# EAGLE design 3yp_node (EAGLE 9.5.2)
DOC_NUM: 1; REV: 2B
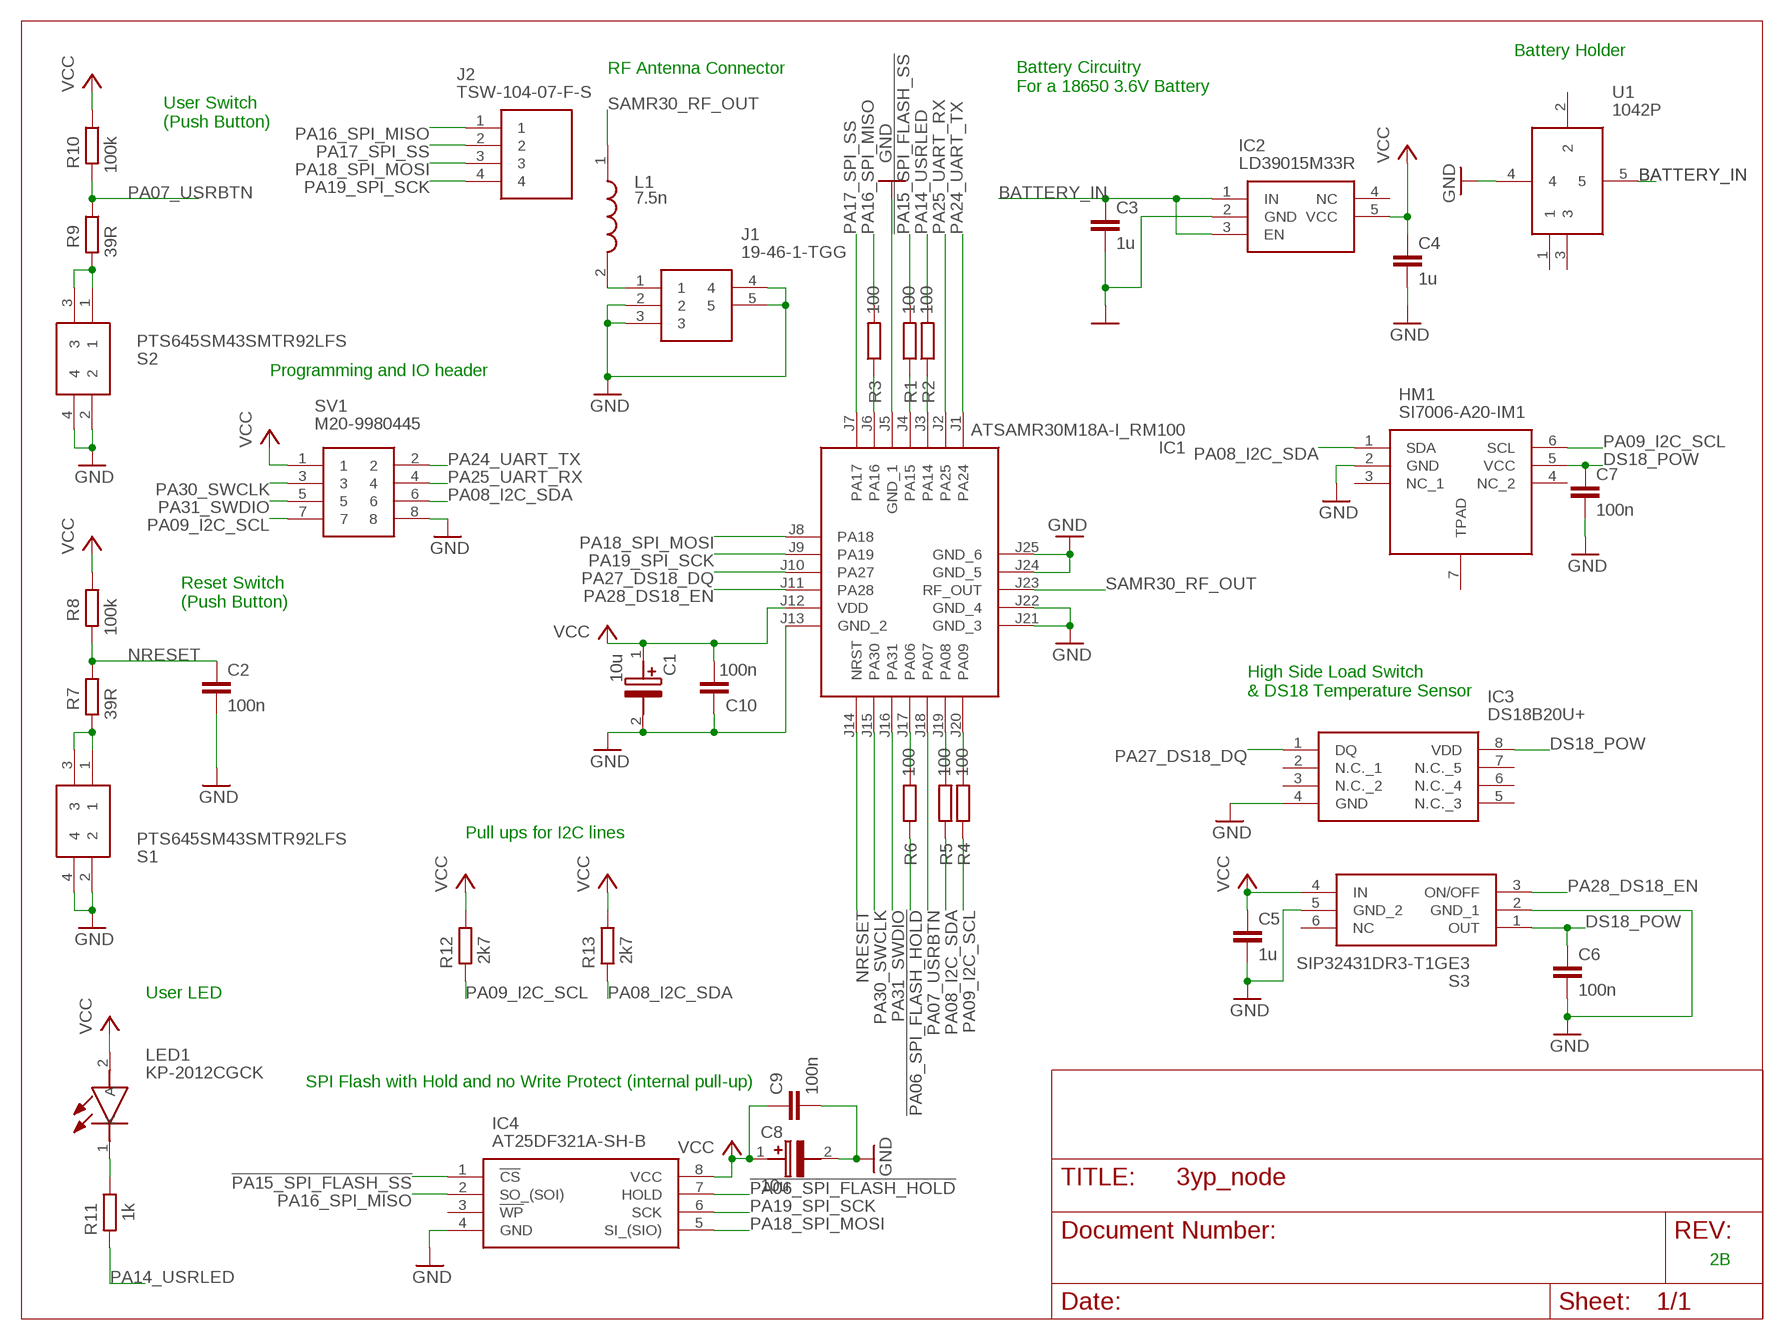
[diagram p0: schematic, sheet 1]

## Parts
C1  10u  TAJP106K006RNJ  [CAPPM2014X170N]
C2  100n  C-EUC0805  [C0805]
C3  1u  C-EUC0805  [C0805]
C4  1u  C-EUC0805  [C0805]
C5  1u  C-EUC0805  [C0805]
C6  100n  C-EUC0805  [C0805]
C7  100n  C-EUC0805  [C0805]
C8  10u  TAJP106K006RNJ  [CAPPM2014X170N]
C9  100n  C-EUC0805  [C0805]
C10  100n  C-EUC0805  [C0805]
HM1  SI7006-A20-IM1  [SON100P300X300X80-7N]
IC1  ATSAMR30M18A-I_RM100  [ATSAMR30M18AIRM100]
IC2  LD39015M33R  [SOT95P280X145-5N]
IC3  DS18B20U+  [SOP65P490X110-8N]
IC4  AT25DF321A-SH-B  [SOIC127P798X216-8N]
J1  19-46-1-TGG  [19-46-1-TGG_1]
J2  TSW-104-07-F-S  [HDRV4W64P254_1X4_1016X241X838P]
L1  7.5n  MHQ1005P10NJT  [INDC1006X60N]
LED1  KP-2012CGCK  [LEDC2012X110N]
R1  100  R-EU_R0603  [R0603]
R2  100  R-EU_R0603  [R0603]
R3  100  R-EU_R0603  [R0603]
R4  100  R-EU_R0603  [R0603]
R5  100  R-EU_R0603  [R0603]
R6  100  R-EU_R0603  [R0603]
R7  39R  R-EU_R0603  [R0603]
R8  100k  R-EU_R0603  [R0603]
R9  39R  R-EU_R0603  [R0603]
R10  100k  R-EU_R0603  [R0603]
R11  1k  R-EU_R0603  [R0603]
R12  2k7  R-EU_R0603  [R0603]
R13  2k7  R-EU_R0603  [R0603]
S1  PTS645SM43SMTR92LFS  [PTS645(SMT)]
S2  PTS645SM43SMTR92LFS  [PTS645(SMT)]
S3  SIP32431DR3-T1GE3  [SOT65P210X110-6N]
SV1  M20-9980445  [HDRV8W64P254_2X4_1016X508X868P]
U1  1042P  [1042P]

## Nets
!PA06_SPI_FLASH_HOLD: IC4.7(HOLD) R6.1
!PA15_SPI_FLASH_SS: IC4.1(!CS) R1.2
BATTERY_IN: C3.1 IC2.1(IN) IC2.3(EN) U1.5
DS18_POW: C6.1 C7.1 HM1.5(VCC) IC3.8(VDD) S3.1(OUT)
GND: C1.2(-) C2.2 C3.2 C4.2 C5.2 C6.2 C7.2 C8.2(-) C9.2 C10.1 HM1.2(GND) IC1.J5(GND_1) IC1.J13(GND_2) IC1.J21(GND_3) IC1.J22(GND_4) IC1.J24(GND_5) IC1.J25(GND_6) IC2.2(GND) IC3.4(GND) IC4.4(GND) J1.2 J1.3 J1.4 J1.5 S1.2 S1.4 S2.2 S2.4 S3.2(GND_1) S3.5(GND_2) SV1.8 U1.4
N$1: R9.2 S2.1 S2.3
N$2: IC1.J4(PA15) R1.1
N$3: IC1.J6(PA16) R3.1
N$4: IC1.J3(PA14) R2.1
N$5: IC1.J17(PA06) R6.2
N$6: IC1.J19(PA08) R5.2
N$7: IC1.J20(PA09) R4.2
N$8: R7.2 S1.1 S1.3
N$9: LED1.1(K) R11.1
N$10: J1.1 L1.2
NRESET: C2.1 IC1.J14(NRST) R7.1 R8.2
PA07_USRBTN: IC1.J18(PA07) R9.1 R10.2
PA08_I2C_SDA: HM1.1(SDA) R5.1 R13.2 SV1.6
PA09_I2C_SCL: HM1.6(SCL) R4.1 R12.2 SV1.7
PA14_USRLED: R2.2 R11.2
PA16_SPI_MISO: IC4.2(SO_(SOI)) J2.1 R3.2
PA17_SPI_SS: IC1.J7(PA17) J2.2
PA18_SPI_MOSI: IC1.J8(PA18) IC4.5(SI_(SIO)) J2.3
PA19_SPI_SCK: IC1.J9(PA19) IC4.6(SCK) J2.4
PA24_UART_TX: IC1.J1(PA24) SV1.2
PA25_UART_RX: IC1.J2(PA25) SV1.4
PA27_DS18_DQ: IC1.J10(PA27) IC3.1(DQ)
PA28_DS18_EN: IC1.J11(PA28) S3.3(ON/OFF)
PA30_SWCLK: IC1.J15(PA30) SV1.3
PA31_SWDIO: IC1.J16(PA31) SV1.5
SAMR30_RF_OUT: IC1.J23(RF_OUT) L1.1
VCC: C1.1(+) C4.1 C5.1 C8.1(+) C9.1 C10.2 IC1.J12(VDD) IC2.5(VCC) IC4.8(VCC) LED1.2(A) R8.1 R10.1 R12.1 R13.1 S3.4(IN) SV1.1
Unconnected: HM1.3(NC_1) HM1.4(NC_2) HM1.7(TPAD) IC2.4(NC) IC3.2(N.C._1) IC3.3(N.C._2) IC3.5(N.C._3) IC3.6(N.C._4) IC3.7(N.C._5) IC4.3(!WP) S3.6(NC) U1.1 U1.2 U1.3

## Notes on the sheet
- Battery Holder
- RF Antenna Connector
- Battery Circuitry
  For a 18650 3.6V Battery
- User Switch
  (Push Button)
- Programming and IO header
- Reset Switch 
  (Push Button)
- High Side Load Switch
  & DS18 Temperature Sensor
- Pull ups for I2C lines
- User LED
- SPI Flash with Hold and no Write Protect (internal pull-up)

## Library data of the parts
C1 C8 = SamacSys_Parts:TAJP106K006RNJ: Tantalum Capacitors - Solid SMD 6.3volts 10uF 10% 0805 Low Profile SMD Source: Datasheet <http://datasheets.avx.com/TAJ.pdf>; DESCRIPTION: Tantalum Capacitors - Solid SMD 6.3volts 10uF 10% 0805 Low Profile SMD; HEIGHT: 1.7mm; MANUFACTURER_NAME: AVX; MANUFACTURER_PART_NUMBER: TAJP106K006RNJ; MOUSER_PART_NUMBER: 581-TAJP106K006RNJ; MOUSER_PRICE-STOCK: https://www.mouser.com/Search/Refine.aspx?Keyword=581-TAJP106K006RNJ
C2-C7 C9 C10 = rcl:C-EU: CAPACITOR, European symbol; SPICEPREFIX: C
HM1 = SamacSys_Parts:SI7006-A20-IM1: Si7006 Digital RH temp sensor w filter Silicon Labs Si7006-A20-IM1 Temperature & Humidity Sensor, -40 +125 C, 6-Pin DFN Source: Datasheet <https://www.silabs.com/documents/public/data-sheets/Si7006-A20.pdf>; DESCRIPTION: Si7006 Digital RH temp sensor w filter Silicon Labs Si7006-A20-IM1 Temperature & Humidity Sensor, -40 +125 C, 6-Pin DFN; HEIGHT: 0.8mm; MANUFACTURER_NAME: Silicon Labs; MANUFACTURER_PART_NUMBER: Si7006-A20-IM1; MOUSER_PART_NUMBER: 634-SI7006-A20-IM1; MOUSER_PRICE-STOCK: https://www.mouser.com/Search/Refine.aspx?Keyword=634-SI7006-A20-IM1; RS_PART_NUMBER: 8652283P; RS_PRICE-STOCK: http://uk.rs-online.com/web/p/products/8652283P
IC1 = SamacSys_Parts:ATSAMR30M18A-I_RM100: Microchip Technology, ATSAMR30M18A-I/RM1 Source: Datasheet <http://www.mouser.com/datasheet/2/268/70005384A-1532404.pdf>; DESCRIPTION: Microchip Technology, ATSAMR30M18A-I/RM1; HEIGHT: 2.1mm; MANUFACTURER_NAME: Microchip; MANUFACTURER_PART_NUMBER: ATSAMR30M18A-I/RM100; MOUSER_PART_NUMBER: 556-AMR30M18AIRM100; MOUSER_PRICE-STOCK: https://www.mouser.com/Search/Refine.aspx?Keyword=556-AMR30M18AIRM100; RS_PART_NUMBER: 1840450; RS_PRICE-STOCK: http://uk.rs-online.com/web/p/products/1840450
IC2 = SamacSys_Parts:LD39015M33R: LD39015M33R, Low Dropout Voltage Regulator, 150mA, 3.3 V +/-2%, 1.5 5.5 Vin, 5-Pin SOT-23 Source: Datasheet <http://www.st.com/web/en/resource/technical/document/datasheet/CD00173477.pdf>; ALLIED_NUMBER: 70521225; ALLIED_PRICE-STOCK: http://www.alliedelec.com/stmicroelectronics-ld39015m33r/70521225/; DESCRIPTION: LD39015M33R, Low Dropout Voltage Regulator, 150mA, 3.3 V +/-2%, 1.5 5.5 Vin, 5-Pin SOT-23; HEIGHT: 1.45mm; MANUFACTURER_NAME: STMicroelectronics; MANUFACTURER_PART_NUMBER: LD39015M33R; MOUSER_PART_NUMBER: 511-LD39015M33R; MOUSER_PRICE-STOCK: https://www.mouser.com/Search/Refine.aspx?Keyword=511-LD39015M33R; RS_PART_NUMBER: 7958965P; RS_PRICE-STOCK: http://uk.rs-online.com/web/p/products/7958965P
IC3 = SamacSys_Parts:DS18B20U+: Board Mount Temperature Sensors Prgmble Resolution 1-Wire Parasite Pwr Source: Datasheet <https://componentsearchengine.com/Datasheets/1/DS18B20U .pdf>; DESCRIPTION: Board Mount Temperature Sensors Prgmble Resolution 1-Wire Parasite Pwr; HEIGHT: 1.1mm; MANUFACTURER_NAME: Maxim Integrated; MANUFACTURER_PART_NUMBER: DS18B20U+; MOUSER_PART_NUMBER: 700-DS18B20U; MOUSER_PRICE-STOCK: https://www.mouser.com/Search/Refine.aspx?Keyword=700-DS18B20U
IC4 = SamacSys_Parts:AT25DF321A-SH-B: Flash Memory 32M 2.7-3.6V, 100Mhz Serial Flash Source: Datasheet <http://docs-emea.rs-online.com/webdocs/0efc/0900766b80efc106.pdf>; DESCRIPTION: Flash Memory 32M 2.7-3.6V, 100Mhz Serial Flash; HEIGHT: 2.16mm; MANUFACTURER_NAME: Adesto Technologies; MANUFACTURER_PART_NUMBER: AT25DF321A-SH-B; MOUSER_PART_NUMBER: 556-AT25DF321A-SH-B; MOUSER_PRICE-STOCK: https://www.mouser.com/Search/Refine.aspx?Keyword=556-AT25DF321A-SH-B
J1 = SamacSys_Parts:19-46-1-TGG: MULTICOMP - 19-46-1-TGG - RF COAXIAL, SMA, STRAIGHT JACK, 50OHM Source: Datasheet <http://www.farnell.com/datasheets/1661858.pdf>; DESCRIPTION: MULTICOMP - 19-46-1-TGG - RF COAXIAL, SMA, STRAIGHT JACK, 50OHM; HEIGHT: mm; MANUFACTURER_NAME: MULTICOMP; MANUFACTURER_PART_NUMBER: 19-46-1-TGG
J2 = SamacSys_Parts:TSW-104-07-F-S: CONN HEADER 4 POS .100" Source: Datasheet <http://suddendocs.samtec.com/catalog_english/tsw_th.pdf>; DESCRIPTION: CONN HEADER 4 POS .100"; HEIGHT: 8.38mm; MANUFACTURER_NAME: SAMTEC; MANUFACTURER_PART_NUMBER: TSW-104-07-F-S; MOUSER_PART_NUMBER: 200-TSW10407FS; MOUSER_PRICE-STOCK: https://www.mouser.com/Search/Refine.aspx?Keyword=200-TSW10407FS; RS_PART_NUMBER: 1612530; RS_PRICE-STOCK: http://uk.rs-online.com/web/p/products/1612530
L1 = SamacSys_Parts:MHQ1005P10NJT: TDK MHQ1005P Series 10 nH +/-5% Ceramic Multilayer SMD Inductor, 0402 Case, SRF: 4.6GHz Q: 23 500mA dc 190m Rdc Source: Datasheet <https://product.tdk.com/info/en/catalog/datasheets/inductor_commercial_high-frequency_mhq1005p_en.pdf>; DESCRIPTION: TDK MHQ1005P Series 10 nH +/-5% Ceramic Multilayer SMD Inductor, 0402 Case, SRF: 4.6GHz Q: 23 500mA dc 190m Rdc; HEIGHT: 0.6mm; MANUFACTURER_NAME: TDK; MANUFACTURER_PART_NUMBER: MHQ1005P10NJT; MOUSER_PART_NUMBER: 810-MHQ1005P10NJT; MOUSER_PRICE-STOCK: https://www.mouser.com/Search/Refine.aspx?Keyword=810-MHQ1005P10NJT; RS_PART_NUMBER: 7958243P; RS_PRICE-STOCK: http://uk.rs-online.com/web/p/products/7958243P
LED1 = SamacSys_Parts:KP-2012CGCK: Green Chip LED 2.0x1.25mm Kingbright KP-2012CGCK Green LED, 570 nm, 2012 (0805), Rectangle Lens SMD Package Source: Datasheet <https://componentsearchengine.com/Datasheets/2/KP-2012CGCK.pdf>; DESCRIPTION: Green Chip LED 2.0x1.25mm Kingbright KP-2012CGCK Green LED, 570 nm, 2012 (0805), Rectangle Lens SMD Package; HEIGHT: 1.1mm; MANUFACTURER_NAME: Kingbright; MANUFACTURER_PART_NUMBER: KP-2012CGCK; MOUSER_PART_NUMBER: N/A; MOUSER_PRICE-STOCK: https://www.mouser.com/Search/Refine.aspx?Keyword=N%2FA; RS_PART_NUMBER: 8610037P; RS_PRICE-STOCK: http://uk.rs-online.com/web/p/products/8610037P
R1-R13 = rcl:R-EU_: RESISTOR, European symbol; SPICEPREFIX: R
S1 S2 = SamacSys_Parts:PTS645SM43SMTR92LFS: C & K COMPONENTS - PTS645SM43SMTR92LFS - SWITCH, SPST, 0.05A, 12VDC, SMD, 4.3MM Source: Datasheet <https://componentsearchengine.com/Datasheets/1/PTS645SM43SMTR92LFS.pdf>; DESCRIPTION: C & K COMPONENTS - PTS645SM43SMTR92LFS - SWITCH, SPST, 0.05A, 12VDC, SMD, 4.3MM; HEIGHT: mm; MANUFACTURER_NAME: C & K COMPONENTS; MANUFACTURER_PART_NUMBER: PTS645SM43SMTR92LFS; MOUSER_PART_NUMBER: 611-PTS645SM43SMTR92; MOUSER_PRICE-STOCK: https://www.mouser.com/Search/Refine.aspx?Keyword=611-PTS645SM43SMTR92
S3 = SamacSys_Parts:SIP32431DR3-T1GE3: VISHAY - SIP32431DR3-T1GE3 - IC, LOAD SWITCH, 1.1V-5.5V, 1A, SC70 Source: Datasheet <https://www.vishay.com/docs/66597/sip32431.pdf>; DESCRIPTION: VISHAY - SIP32431DR3-T1GE3 - IC, LOAD SWITCH, 1.1V-5.5V, 1A, SC70; HEIGHT: 1.1mm; MANUFACTURER_NAME: Vishay; MANUFACTURER_PART_NUMBER: SIP32431DR3-T1GE3; MOUSER_PART_NUMBER: 781-SIP32431DR3-GE3; MOUSER_PRICE-STOCK: https://www.mouser.com/Search/Refine.aspx?Keyword=781-SIP32431DR3-GE3; RS_PART_NUMBER: 1807353; RS_PRICE-STOCK: http://uk.rs-online.com/web/p/products/1807353
SV1 = SamacSys_Parts:M20-9980445: M20 Header, Pin, Dil, Vertical, 4+4 W HARWIN M20 Series, 2.54mm Pitch 8 Way 2 Row Straight Pin Header, Through Hole, Solder Termination Source: Datasheet <https://componentsearchengine.com/Datasheets/1/M20-9980445.pdf>; ALLIED_NUMBER: R1052696; ALLIED_PRICE-STOCK: https://www.alliedelec.com/harwin-m20-9980445/R1052696/; DESCRIPTION: M20 Header, Pin, Dil, Vertical, 4+4 W HARWIN M20 Series, 2.54mm Pitch 8 Way 2 Row Straight Pin Header, Through Hole, Solder Termination; HEIGHT: 8.68mm; MANUFACTURER_NAME: HARWIN; MANUFACTURER_PART_NUMBER: M20-9980445; MOUSER_PART_NUMBER: 855-M20-9980445; MOUSER_PRICE-STOCK: https://www.mouser.com/Search/Refine.aspx?Keyword=855-M20-9980445; RS_PART_NUMBER: 6812941P; RS_PRICE-STOCK: http://uk.rs-online.com/web/p/products/6812941P
U1 = SamacSys_Parts:1042P: KEYSTONE - 1042P - BATTERY HOLDER, 18650, SMD Source: Datasheet <https://componentsearchengine.com/Datasheets/1/1042P.pdf>; DESCRIPTION: KEYSTONE - 1042P - BATTERY HOLDER, 18650, SMD; HEIGHT: 14mm; MANUFACTURER_NAME: Keystone Electronics; MANUFACTURER_PART_NUMBER: 1042P; MOUSER_PART_NUMBER: 534-1042P; MOUSER_PRICE-STOCK: https://www.mouser.com/Search/Refine.aspx?Keyword=534-1042P

## Board
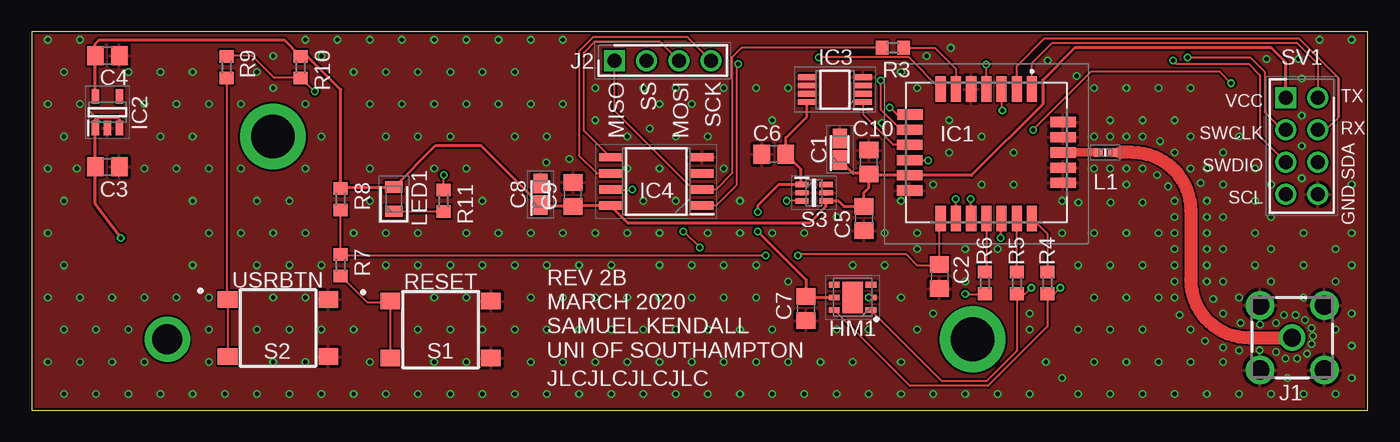
[diagram p1: board, top side]
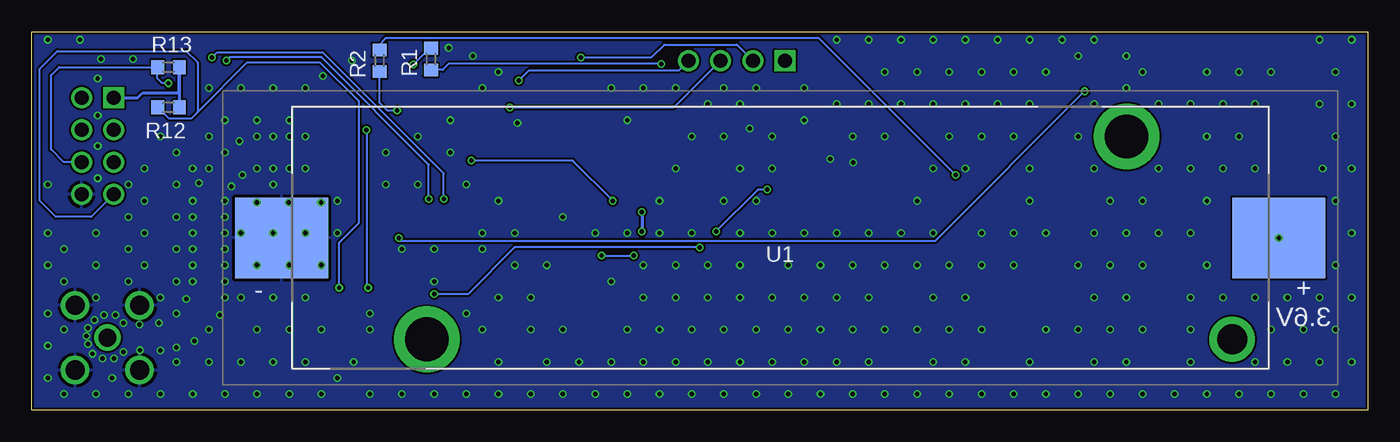
[diagram p2: board, bottom side, seen from below]

Size 105.41 x 29.84 mm. Coordinates in mm from the lower left corner, seen from the top.
Outline: 0,0 105.41,0 105.41,29.84 0,29.84 0,0
Copper layers (1*16): Top 0.035559375mm / dielectric 1.6mm / Bottom 0.035559375mm
Design rules "jlcpcb2layer *": minimum track width 5mil, minimum drill 12mil, track to track 5mil, track to pad 5mil, pad to pad 5mil, via to via 5mil, smd to smd 5mil, copper to edge 8mil, drill to drill 6mil, minimum pad ring 5mil, minimum via ring 3mil, stop-mask expansion 2.5mil, vias tented up to drill 0.35mm, thermal gap 10mil
tRestrict: area 84.6,20 to 84.8,20.6

### Footprints (pad centres in the part's own frame; a part is rotated, then mirrored left to right if it is on the bottom)
CAPPM2014X170N = smd 1.55 x 1.1: 1 -0.85,0; 2 0.85,0
C0805 = smd 1.3 x 1.5: 1 -0.95,0; 2 0.95,0
SON100P300X300X80-7N = smd 0.85 x 0.45: 1 -1.45,1; 2 -1.45,0; 3 -1.45,-1; 4 1.45,-1; 5 1.45,0; 6 1.45,1 | smd 1.6 x 2.5: 7 0,0
ATSAMR30M18AIRM100 = smd 0.8 x 2: J1 -3.6,-5; J2 -2.4,-5; J3 -1.2,-5; J4 0,-5; J5 1.2,-5; J6 2.4,-5; J7 3.6,-5; J14 3.6,5.2; J15 2.4,5.2; J16 1.2,5.2; J17 0,5.2; J18 -1.2,5.2; J19 -2.4,5.2; J20 -3.6,5.2 | smd 2 x 0.8: J8 6,-3; J9 6.05,-1.8; J10 6.05,-0.6; J11 6.05,0.6; J12 6.05,1.8; J13 6.05,3; J21 -6.05,2.4; J22 -6.05,1.2; J23 -6.05,0; J24 -6.05,-1.2; J25 -6.05,-2.4
SOT95P280X145-5N = smd 1.15 x 0.6: 1 -1.25,0.95; 2 -1.25,0; 3 -1.25,-0.95; 4 1.25,-0.95; 5 1.25,0.95
SOP65P490X110-8N = smd 1.425 x 0.45: 1 -2.212,0.975; 2 -2.212,0.325; 3 -2.212,-0.325; 4 -2.212,-0.975; 5 2.212,-0.975; 6 2.212,-0.325; 7 2.212,0.325; 8 2.212,0.975
SOIC127P798X216-8N = smd 1.75 x 0.65: 1 -3.625,1.905; 2 -3.625,0.635; 3 -3.625,-0.635; 4 -3.625,-1.905; 5 3.625,-1.905; 6 3.625,-0.635; 7 3.625,0.635; 8 3.625,1.905
19-46-1-TGG_1 = drill 1.4 pad 2.1: 1 0,0 | drill 1.5 pad 2.25: 2 -2.55,2.55; 3 2.55,2.55; 4 -2.55,-2.55; 5 2.55,-2.55
HDRV4W64P254_1X4_1016X241X838P = drill 1.1 pad 1.65 square: 1 0,0 | drill 1.1 pad 1.65: 2 2.54,0; 3 5.08,0; 4 7.62,0
INDC1006X60N = smd 0.7 x 0.7: 1 -0.55,0; 2 0.55,0
LEDC2012X110N = smd 0.9 x 1.4: 1 -0.95,0; 2 0.95,0
R0603 = smd 1 x 1.1: 1 -0.85,0; 2 0.85,0
PTS645(SMT) = smd 1.55 x 1.3: 1 -3.975,2.25; 2 3.975,2.25; 3 -3.975,-2.25; 4 3.975,-2.25
SOT65P210X110-6N = smd 1.05 x 0.4: 1 -0.95,0.65; 2 -0.95,0; 3 -0.95,-0.65; 4 0.95,-0.65; 5 0.95,0; 6 0.95,0.65
HDRV8W64P254_2X4_1016X508X868P = drill 1.1 pad 1.65 square: 1 0,0 | drill 1.1 pad 1.65: 2 0,2.54; 3 2.54,0; 4 2.54,2.54; 5 5.08,0; 6 5.08,2.54; 7 7.62,0; 8 7.62,2.54
1042P = drill 3.45 pad 5.175: 1 -27.87,-8; 2 27.33,8 | drill 2.39 pad 3.585: 3 35.66,-8 | smd 7.34 x 6.35: 4 -39.33,0; 5 39.33,0

### Placement (x,y rotation side)
C1  63.75,20.57 90 top
C2  71.63,10.54 270 top
C3  5.97,19.18 0 top
C4  5.97,27.94 0 top
C5  65.66,15.11 270 top
C6  58.55,20.19 180 top
C7  61.09,8 270 top
C8  40.13,17.02 90 top
C9  42.7,17.02 90 top
C10  66.04,19.56 270 top
HM1  64.77,8.89 180 top
IC1  75.31,20.32 180 top
IC2  5.97,23.5 90 top
IC3  63.37,25.27 180 top
IC4  49.28,18.03 180 top
J1  99.44,5.71 0 top
J2  45.97,27.56 0 top
L1  84.71,20.32 0 top
LED1  28.57,16.64 90 top
R1  73.91,27.69 270 bottom
R2  77.98,27.56 90 bottom
R3  67.94,28.57 180 top
R4  80.14,10.03 90 top
R5  77.72,10.03 90 top
R6  75.18,10.03 90 top
R7  24.38,11.43 270 top
R8  24.38,16.64 270 top
R9  15.37,27.05 270 top
R10  21.21,27.05 270 top
R11  32.51,16.51 90 top
R12  94.61,23.88 180 bottom
R13  94.61,27.05 180 bottom
S1  32.26,6.35 0 top
S2  19.43,6.48 0 top
S3  61.72,17.14 0 top
SV1  98.93,24.64 270 top
U1  46.35,13.59 0 bottom

### Tracks (layer width: path | path; a pad name or v marks a point on that pad's centre or on a via)
!PA06_SPI_FLASH_HOLD  (via drill 0.35 pad 0.6)
  Top 0.152: IC4.7 v47.37,17.4 | v52.7,12.83 51.44,14.1 v51.42,14.1 | v73.66,9.14 75.14,9.14 R6.1
  Bottom 0.152: v47.37,17.4 48.12,17.4 v51.42,14.1 | v52.7,12.83 67.31,12.83 70.99,9.14 v73.66,9.14
!PA15_SPI_FLASH_SS  (via drill 0.35 pad 0.6)
  Top 0.152: IC4.1 53.98,16.13 55.63,17.78 55.63,27.18 v55.75,27.3
  Bottom 0.152: v55.75,27.3 72.52,27.3 72.99,26.84 R1.2
BATTERY_IN  (via drill 0.35 pad 0.6)
  Top 0.254: v7.03,13.59 5.02,16.23 C3.1 IC2.1 5.02,22.93 5.21,23.11 6.73,23.11 6.92,22.93 IC2.3
DS18_POW  (via drill 0.35 pad 0.6)
  Top 0.254: IC3.8 61.16,23.16 59.5,21.49 C6.1 60.71,18.98 60.71,17.86 S3.1 60.76,17.78 58.93,17.78 57.28,16.13 v57.28,15.62 | v57.28,14.1 61.09,10.29 C7.1 61.15,8.89 HM1.5
  Bottom 0.254: v57.28,15.62 v57.28,14.1
GND  (via drill 0.35 pad 0.6)
  other vias: 86.36,21.59 87.63,21.59 89.03,21.21 90.17,20.32 91.44,19.05 91.44,21.59 92.71,19.05 92.2,17.91 92.71,16.51 92.71,15.24 92.71,13.97 92.71,12.7 92.71,11.43 92.71,10.16 93.22,8.76 93.98,7.62 95.38,6.86 98.17,6.86 98.81,7.49 98.17,4.57 98.93,4.06 99.82,4.06 100.61,4.45 99.69,7.49 100.46,7.11 100.97,6.48 100.97,5.21 101.09,5.84 93.98,4.95 91.44,6.35 90.17,10.16 90.17,11.43 90.17,12.7 90.17,13.97 90.17,15.24 90.17,16.51 89.66,17.65 88.77,18.54 87.63,19.05 86.36,19.05 86.36,17.78 90.17,8.89 90.55,7.49 92.58,5.46 95.25,4.7 86.36,25.4 88.9,25.4 83.82,25.4 83.82,21.59 96.52,19.05 96.52,16.51 95.25,21.59 96.52,13.97 96.52,11.43 95.25,8.89 97.79,12.7 97.79,10.16 97.79,15.24 97.79,17.78 100.33,13.97 100.33,11.43 102.87,12.7 104.14,11.43 104.14,17.78 87.66,16.38 86.36,13.97 87.63,11.43 86.36,8.89 87.63,6.35 86.36,3.81 87.63,1.27 88.9,3.81 90.17,1.27 91.44,3.81 92.71,1.27 93.98,3.81 95.25,1.27 97.79,1.27 100.33,1.27 102.87,1.27 104.14,7.62 104.14,5.08 104.14,2.54 85.09,11.43 85.09,6.35 85.09,1.27 83.82,3.81 83.82,8.89 82.55,11.43 83.82,13.97 82.58,16.38 83.82,19.05 85.12,16.38 85.09,19.05 85.09,21.59 104.14,13.97 101.6,29.21 80.14,27.56 48.26,25.4 52.07,24.13 44.45,25.4 50.8,16.51 55.88,16.51 41.91,29.21 41.91,24.13 40.64,21.59 39.37,24.13 38.1,26.67 39.37,29.21 36.83,29.21 35.56,26.67 33.02,26.67 30.48,26.67 27.94,26.67 25.4,26.67 26.67,29.21 29.21,29.21 31.75,29.21 34.29,29.21 36.83,24.13 34.29,24.13 31.75,24.13 29.21,24.13 26.67,24.13 27.94,21.59 30.48,21.59 33.02,21.59 38.1,21.59 26.67,19.05 38.1,11.43 39.37,8.89 40.64,6.35 40.64,11.43 38.1,6.35 40.64,1.27 38.1,1.27 35.56,1.27 33.02,1.27 30.48,1.27 27.94,1.27 25.4,1.27 22.86,1.27 20.32,1.27 17.78,1.27 15.24,1.27 20.32,6.35 17.78,6.35 19.05,8.89 20.32,11.43 21.59,8.89 30.48,6.35 33.02,6.35 31.75,8.89 34.29,8.89 33.02,11.43 30.48,11.43 35.56,11.43 27.94,11.43 35.56,6.35 34.29,3.81 31.75,3.81 39.37,3.81 26.67,3.81 25.4,6.35 22.86,6.35 19.05,3.81 21.59,3.81 12.7,1.27 13.97,3.81 13.97,8.89 11.43,8.89 10.16,1.27 13.97,6.35 17.78,11.43 19.05,13.97 21.59,13.97 22.86,11.43 16.51,13.97 17.78,16.51 20.32,16.51 21.59,19.05 16.51,19.05 22.86,21.59 21.59,24.13 19.05,25.4 16.51,24.13 72.39,20.32 74.93,21.59 72.39,22.86 69.85,25.4 68.58,26.67 70.61,27.94 59.69,25.4 57.15,25.4 41.91,8.89 41.91,3.81 26.67,16.51 25.4,13.97 27.94,13.97 30.48,13.97 31.75,19.05 41.91,13.97 39.37,13.97 36.83,13.97 34.29,13.97 35.56,16.51 44.45,13.97 46.99,13.97 49.53,13.97 55.88,13.97 58.42,13.97 60.96,13.97 63.5,15.24 67.31,13.97 68.58,16.51 69.85,13.97 71.12,17.78 43.18,11.43 43.18,6.35 43.18,1.27 8.89,3.81 8.89,8.89 12.7,11.43 13.97,13.97 12.7,16.51 13.97,19.05 12.7,21.59 11.43,19.05 8.89,19.05 10.16,21.59 11.43,24.13 13.97,24.13 8.89,24.13 10.16,26.67 12.7,26.67 7.62,26.67 17.78,26.67 19.05,27.94 24.13,29.21 21.59,29.21 22.86,27.94 82.55,6.35 82.55,1.27 73.66,12.7 73.66,10.16 71.12,7.62 68.58,8.89 66.04,8.89 69.85,12.7 76.2,12.7 82.45,26.34 74.93,17.78 77.47,17.78 77.47,20.32 81.28,16.51 88.9,8.89 88.9,13.97 85.09,22.86 87.63,22.86 90.17,22.86 93.98,17.78 93.98,15.24 93.98,12.7 93.98,10.16 93.98,20.32 99.95,27.69 104.14,29.21 96.88,4.72 96.9,6.76 1.27,29.21 3.81,29.21 2.54,26.67 1.27,24.13 3.81,24.13 2.54,21.59 1.27,19.05 3.56,19.05 2.54,16.51 1.27,13.97 2.54,11.43 1.27,8.89 3.81,8.89 6.35,8.89 5.08,6.35 7.62,6.35 2.54,6.35 1.27,3.81 3.81,3.81 6.35,3.81 5.08,1.27 2.54,1.27 7.62,1.27 50.8,25.4 42.42,19.81 48.26,16.51 49.53,19.05 46.99,19.05 50.8,21.59 49.53,24.13 54.61,25.4 53.34,21.59 44.45,22.86 46.99,21.59 54.61,19.05 48.77,22.23 91.44,25.4 67.31,11.43 53.34,13.97 100.33,8.89 102.87,10.16 102.87,6.35 99.06,2.54 64.77,11.43 57.15,11.43 54.61,11.43 52.07,11.43 49.53,11.43 45.72,11.43 44.45,8.89 46.99,8.89 49.53,8.89 52.07,8.89 54.61,8.89 57.15,8.89 44.45,3.81 45.72,6.35 97.41,27.69 100.2,26.16 100.2,20.83 100.2,18.29 100.2,23.24 81.28,13.97 66.04,6.35 68.58,3.81 78.74,7.62 78.74,6.35 69.85,6.35 62.23,3.81 63.5,1.27 64.77,3.81 63.5,6.35 60.96,1.27 66.04,1.27 68.58,1.27 71.12,1.27 73.66,1.27 76.2,1.27 78.74,1.27 80.01,3.81 81.28,2.54 59.69,3.81 58.42,6.35 58.42,1.27 55.88,1.27 57.15,3.81 55.88,6.35 45.72,1.27 48.26,1.27 50.8,1.27 53.34,1.27 52.07,3.81 49.53,3.81 46.99,3.81 54.61,3.81 53.34,6.35 50.8,6.35 48.26,6.35 59.69,10.16 34.29,19.05 72.52,28.57 40.61,19.53 58.42,22.86 67.08,22.66
  pour Top (isolate 0.152): -3.56,50.93 -3.56,-7.62 113.41,-7.62 113.41,50.93
  pour Bottom (isolate 0.152): 107.19,49.53 107.19,-9.14 -5.71,-9.14 -5.71,49.53
N$1
  Top 0.152: S2.3 S2.1 15.37,8.82 R9.2
N$2  (via drill 0.35 pad 0.6)
  Top 0.152: IC1.J4 v75.31,27.25
  Bottom 0.152: v75.31,27.25 74.03,28.54 R1.1
N$3
  Top 0.152: R3.1 71.25,28.57 72.91,26.91 IC1.J6
N$4  (via drill 0.35 pad 0.6)
  Top 0.152: IC1.J3 76.51,23.69 v76.58,23.62
  Bottom 0.152: v76.58,23.62 77.34,23.62 77.98,24.26 R2.1
N$5
  Top 0.152: IC1.J17 75.31,11.01 R6.2
N$6
  Top 0.152: R5.2 77.72,15.11 IC1.J19
N$7
  Top 0.152: IC1.J20 80.14,13.89 R4.2
N$8
  Top 0.152: S1.1 28.28,8.51 | 28.28,8.51 S1.3 | R7.2 26.45,8.51 28.28,8.51
N$9
  Top 0.152: LED1.1 32.48,15.69 R11.1
N$10
  Top 0.406: L1.2 85.89,20.32
  Top 1.016: 85.89,20.32 86.87,20.32 arc-90 91.44,15.75 91.44,10.29 arc90 96.01,5.71 J1.1
NRESET  (via drill 0.35 pad 0.6)
  Top 0.152: R7.1 24.38,12.32 | 24.38,12.32 R8.2 | IC1.J14 71.63,15.04 C2.1 71.57,11.43 69.85,11.43 69,12.28 60.54,12.28 v60.45,12.19 | v57.91,12.19 24.51,12.19 24.38,12.32
  Bottom 0.152: v60.45,12.19 v57.91,12.19
PA07_USRBTN  (via drill 0.35 pad 0.6)
  Top 0.152: R9.1 15.41,27.94 17.4,27.94 19.14,26.2 R10.2 22.26,25.15 v22.35,25.15 | v76.45,13.59 76.45,15.06 IC1.J18
  Bottom 0.152: v22.35,25.15 34.16,13.34 76.33,13.34 76.45,13.46 v76.45,13.59
PA08_I2C_SDA  (via drill 0.35 pad 0.6)
  Top 0.152: v78.87,9.65 v78.87,9.64 78.41,9.18 R5.1 77.72,4.7 75.31,2.29 71.82,2.29 HM1.1 | v78.99,22.1 83.61,26.71 93.68,26.71 v94.61,25.78
  Bottom 0.152: SV1.6 102.87,19.56 103.89,20.57 103.89,26.42 103.25,27.05 R13.2 95.5,27.01 95.5,26.16 95.12,25.78 v94.61,25.78 | v78.99,22.1 78.99,9.78 v78.87,9.65
PA09_I2C_SCL  (via drill 0.35 pad 0.6)
  Top 0.152: v81.15,9.65 80.68,9.18 R4.1 80.14,6.6 75.44,1.91 69.31,1.91 HM1.6
  Bottom 0.152: SV1.7 100.71,15.24 103.5,15.24 104.78,16.51 104.78,26.92 103.38,28.32 93.22,28.32 92.33,27.43 92.33,23.5 | 92.33,23.5 92.84,22.99 94.58,22.99 R12.2 | v81.15,9.65 81.15,13.21 79.63,14.73 79.63,24.38 82.68,27.43 88.39,27.43 92.33,23.5
PA14_USRLED  (via drill 0.35 pad 0.6)
  Top 0.152: R11.2 v32.51,18.54
  Bottom 0.152: v32.51,18.54 43.31,29.34 77.47,29.34 77.98,28.83 R2.2
PA16_SPI_MISO
  Top 0.152: J2.1 45.97,23.62 52.2,17.4 IC4.2 53.98,17.4 55.24,18.67 55.24,27.81 56.01,28.57 R3.2
PA17_SPI_SS  (via drill 0.35 pad 0.6)
  Top 0.152: IC1.J7 69.22,27.81 v62.1,27.81
  Bottom 0.152: v62.1,27.81 56.52,27.81 55.5,28.83 49.78,28.83 J2.2
PA18_SPI_MOSI  (via drill 0.35 pad 0.6)
  Top 0.152: IC4.5 43.56,22.03 43.56,28.19 44.45,29.08 49.53,29.08 J2.3 | IC1.J8 68.25,23.32 v67.69,23.88
  Bottom 0.152: v67.69,23.88 54.74,23.88 J2.3
PA19_SPI_SCK  (via drill 0.35 pad 0.6)
  Top 0.152: J2.4 51.74,29.41 44.27,29.41 43.18,28.32 43.18,20.07 44.58,18.67 IC4.6 | IC1.J9 68.56,22.12 66.98,23.7 v66.98,25.98
  Bottom 0.152: J2.4 54.36,26.8 66.17,26.8 v66.98,25.98
PA24_UART_TX
  Top 0.152: IC1.J1 78.91,27.35 80.52,28.96 99.82,28.96 101.47,27.3 SV1.2
PA25_UART_RX
  Top 0.152: IC1.J2 77.71,27.14 79.88,29.31 99.97,29.31 103.12,26.16 103.12,23.11 102.11,22.1 SV1.4
PA27_DS18_DQ
  Top 0.152: IC1.J10 67.98,20.92 65.58,23.32 IC3.1
PA28_DS18_EN  (via drill 0.35 pad 0.6)
  Top 0.152: S3.3 59.58,16.5 v59.56,16.51 | v70.74,19.68 69.3,19.68 IC1.J11
  Bottom 0.152: v59.56,16.51 62.74,19.68 v70.74,19.68
PA30_SWCLK  (via drill 0.35 pad 0.6)
  Top 0.152: IC1.J15 72.91,16.62 v72.9,16.64 | v91.19,27.81 96.14,27.81 97.28,26.67 97.28,23.5 98.68,22.1 SV1.3
  Bottom 0.152: v72.9,16.64 72.9,18.67 82.42,28.19 90.81,28.19 v91.19,27.81
PA31_SWDIO  (via drill 0.35 pad 0.6)
  Top 0.152: IC1.J16 74.11,16.62 v74.09,16.64 | v90.04,27.56 90.3,27.3 96.01,27.3 96.9,26.42 96.9,21.59 SV1.5
  Bottom 0.152: v74.09,16.64 74.09,19.36 82.55,27.81 89.79,27.81 v90.04,27.56
SAMR30_RF_OUT
  Top 0.66: IC1.J23 83.82,20.32 L1.1
VCC
  Top 0.254: IC2.5 C4.1 5.02,28.89 5.33,29.21 19.9,29.21 21.19,27.92 | 21.19,27.92 R10.1 | 21.19,27.92 21.74,27.92 24.38,25.27 R8.1 24.48,17.59 LED1.2 31.88,20.89 35.41,20.89 C8.1 40.23,16.07 C9.1 42.76,16.13 IC4.8 47,14.78 61.39,14.78 62.67,16.06 S3.4 63.64,16.5 64.07,16.06 C5.1 65.66,17.14 66.04,17.53 C10.2 | SV1.1 98.93,27.43 97.79,28.57 82.3,28.57 79.76,26.04 79.76,24.13 74.15,18.52 IC1.J12 66.13,18.52 C10.2 | C10.2 65.98,18.67 64.81,18.67 C1.1
  Bottom 0.254: R12.1 R13.1 93.77,25.02 96.65,25.02 97.03,24.64 SV1.1

### Text on the board
tPlace: MISO | SS | MOSI | SCK | TX | VCC | RX | SWCLK | SWDIO | SDA | SCL | GND | USRBTN | RESET | REV 2B / MARCH 2020 / SAMUEL KENDALL / UNI OF SOUTHAMPTON | JLCJLCJLCJLC
bPlace: - | + / 3.6V